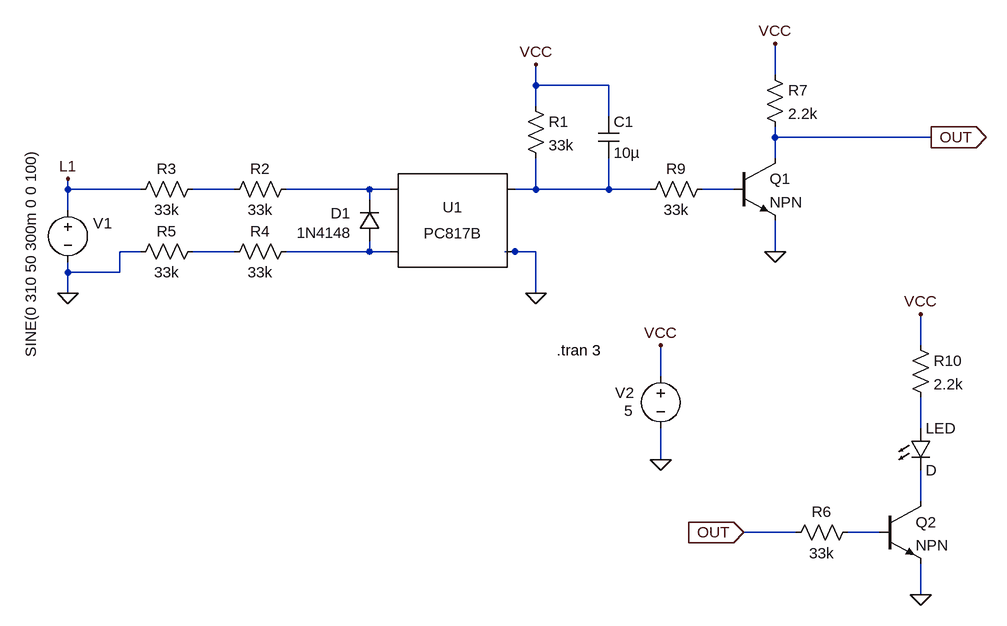
[diagram p0: schematic v1.4.asc]
v1.4.asc, the LTspice schematic file:
Version 4.1
SHEET 1 1292 820
WIRE 720 -48 720 -96
WIRE 352 -32 352 -64
WIRE 464 -32 352 -32
WIRE 352 0 352 -32
WIRE 464 16 464 -32
WIRE 720 48 720 32
WIRE 960 48 720 48
WIRE 720 80 720 48
WIRE -368 128 -368 112
WIRE -256 128 -368 128
WIRE -112 128 -176 128
WIRE 96 128 -32 128
WIRE 128 128 96 128
WIRE 352 128 352 80
WIRE 352 128 320 128
WIRE 464 128 464 80
WIRE 464 128 352 128
WIRE 528 128 464 128
WIRE 656 128 608 128
WIRE 96 144 96 128
WIRE -368 160 -368 128
WIRE -256 224 -288 224
WIRE -112 224 -176 224
WIRE 96 224 96 208
WIRE 96 224 -32 224
WIRE 128 224 96 224
WIRE 320 224 304 224
WIRE 352 224 320 224
WIRE 720 224 720 176
WIRE -368 256 -368 240
WIRE -288 256 -288 224
WIRE -288 256 -368 256
WIRE -368 288 -368 256
WIRE 352 288 352 224
WIRE 944 368 944 320
WIRE 544 416 544 368
WIRE 944 496 944 448
WIRE 544 544 544 496
WIRE 944 608 944 560
WIRE 752 656 672 656
WIRE 880 656 832 656
WIRE 944 752 944 704
FLAG -368 288 0
FLAG 544 544 0
FLAG -368 112 L1
FLAG 352 288 0
FLAG 544 368 VCC
FLAG 352 -64 VCC
FLAG 720 224 0
FLAG 720 -96 VCC
FLAG 960 48 OUT
IOPIN 960 48 Out
FLAG 944 752 0
FLAG 944 320 VCC
FLAG 672 656 OUT
IOPIN 672 656 In
SYMBOL Optos\\PC817B 224 176 R0
SYMATTR InstName U1
SYMBOL res 336 -16 R0
SYMATTR InstName R1
SYMATTR Value 33k
SYMBOL voltage -368 144 R0
WINDOW 123 0 0 Left 0
WINDOW 39 0 0 Left 0
WINDOW 0 39 36 Left 2
WINDOW 3 -57 -79 VRight 2
SYMATTR InstName V1
SYMATTR Value SINE(0 310 50 300m 0 0 100)
SYMBOL res -16 112 R90
WINDOW 0 0 56 VBottom 2
WINDOW 3 32 56 VTop 2
SYMATTR InstName R2
SYMATTR Value 33k
SYMBOL voltage 544 400 R0
WINDOW 123 0 0 Left 0
WINDOW 39 0 0 Left 0
WINDOW 0 -70 41 Left 2
WINDOW 3 -56 69 Left 2
SYMATTR InstName V2
SYMATTR Value 5
SYMBOL res -160 112 R90
WINDOW 0 0 56 VBottom 2
WINDOW 3 32 56 VTop 2
SYMATTR InstName R3
SYMATTR Value 33k
SYMBOL res -16 208 R90
WINDOW 0 0 56 VBottom 2
WINDOW 3 32 56 VTop 2
SYMATTR InstName R4
SYMATTR Value 33k
SYMBOL res -160 208 R90
WINDOW 0 0 56 VBottom 2
WINDOW 3 32 56 VTop 2
SYMATTR InstName R5
SYMATTR Value 33k
SYMBOL diode 112 208 R180
WINDOW 0 45 43 Left 2
WINDOW 3 43 13 Left 2
SYMATTR InstName D1
SYMATTR Value 1N4148
SYMBOL cap 448 16 R0
SYMATTR InstName C1
SYMATTR Value 10µ
SYMBOL npn 656 80 R0
SYMATTR InstName Q1
SYMBOL res 624 112 R90
WINDOW 0 0 56 VBottom 2
WINDOW 3 32 56 VTop 2
SYMATTR InstName R9
SYMATTR Value 33k
SYMBOL LED 928 496 R0
SYMATTR InstName LED
SYMBOL res 704 -64 R0
SYMATTR InstName R7
SYMATTR Value 2.2k
SYMBOL npn 880 608 R0
SYMATTR InstName Q2
SYMBOL res 848 640 R90
WINDOW 0 0 56 VBottom 2
WINDOW 3 32 56 VTop 2
SYMATTR InstName R6
SYMATTR Value 33k
SYMBOL res 928 352 R0
SYMATTR InstName R10
SYMATTR Value 2.2k
TEXT 384 376 Left 2 !.tran 3

The netlist it stands for:
* v1.4.asc
X§U1 N002 N006 N003 0 PC817 Igain=1.5m
R1 VCC N003 33k
V1 L1 0 SINE(0 310 50 300m 0 0 100)
R2 N002 N001 33k
V2 VCC 0 5
R3 N001 L1 33k
R4 N006 N005 33k
R5 N005 0 33k
D1 N006 N002 1N4148
C1 VCC N003 10µ
Q1 OUT N004 0 0 NPN
R9 N004 N003 33k
D§LED N007 N008 D
R7 VCC OUT 2.2k
Q2 N008 N009 0 0 NPN
R6 N009 OUT 33k
R10 VCC N007 2.2k
.model D D
.lib standard.dio
.model NPN NPN
.model PNP PNP
.lib standard.bjt
.tran 3
.lib PC817.sub
.backanno
.end